# EAGLE schematic EasyBMS (EAGLE 9.6.2)
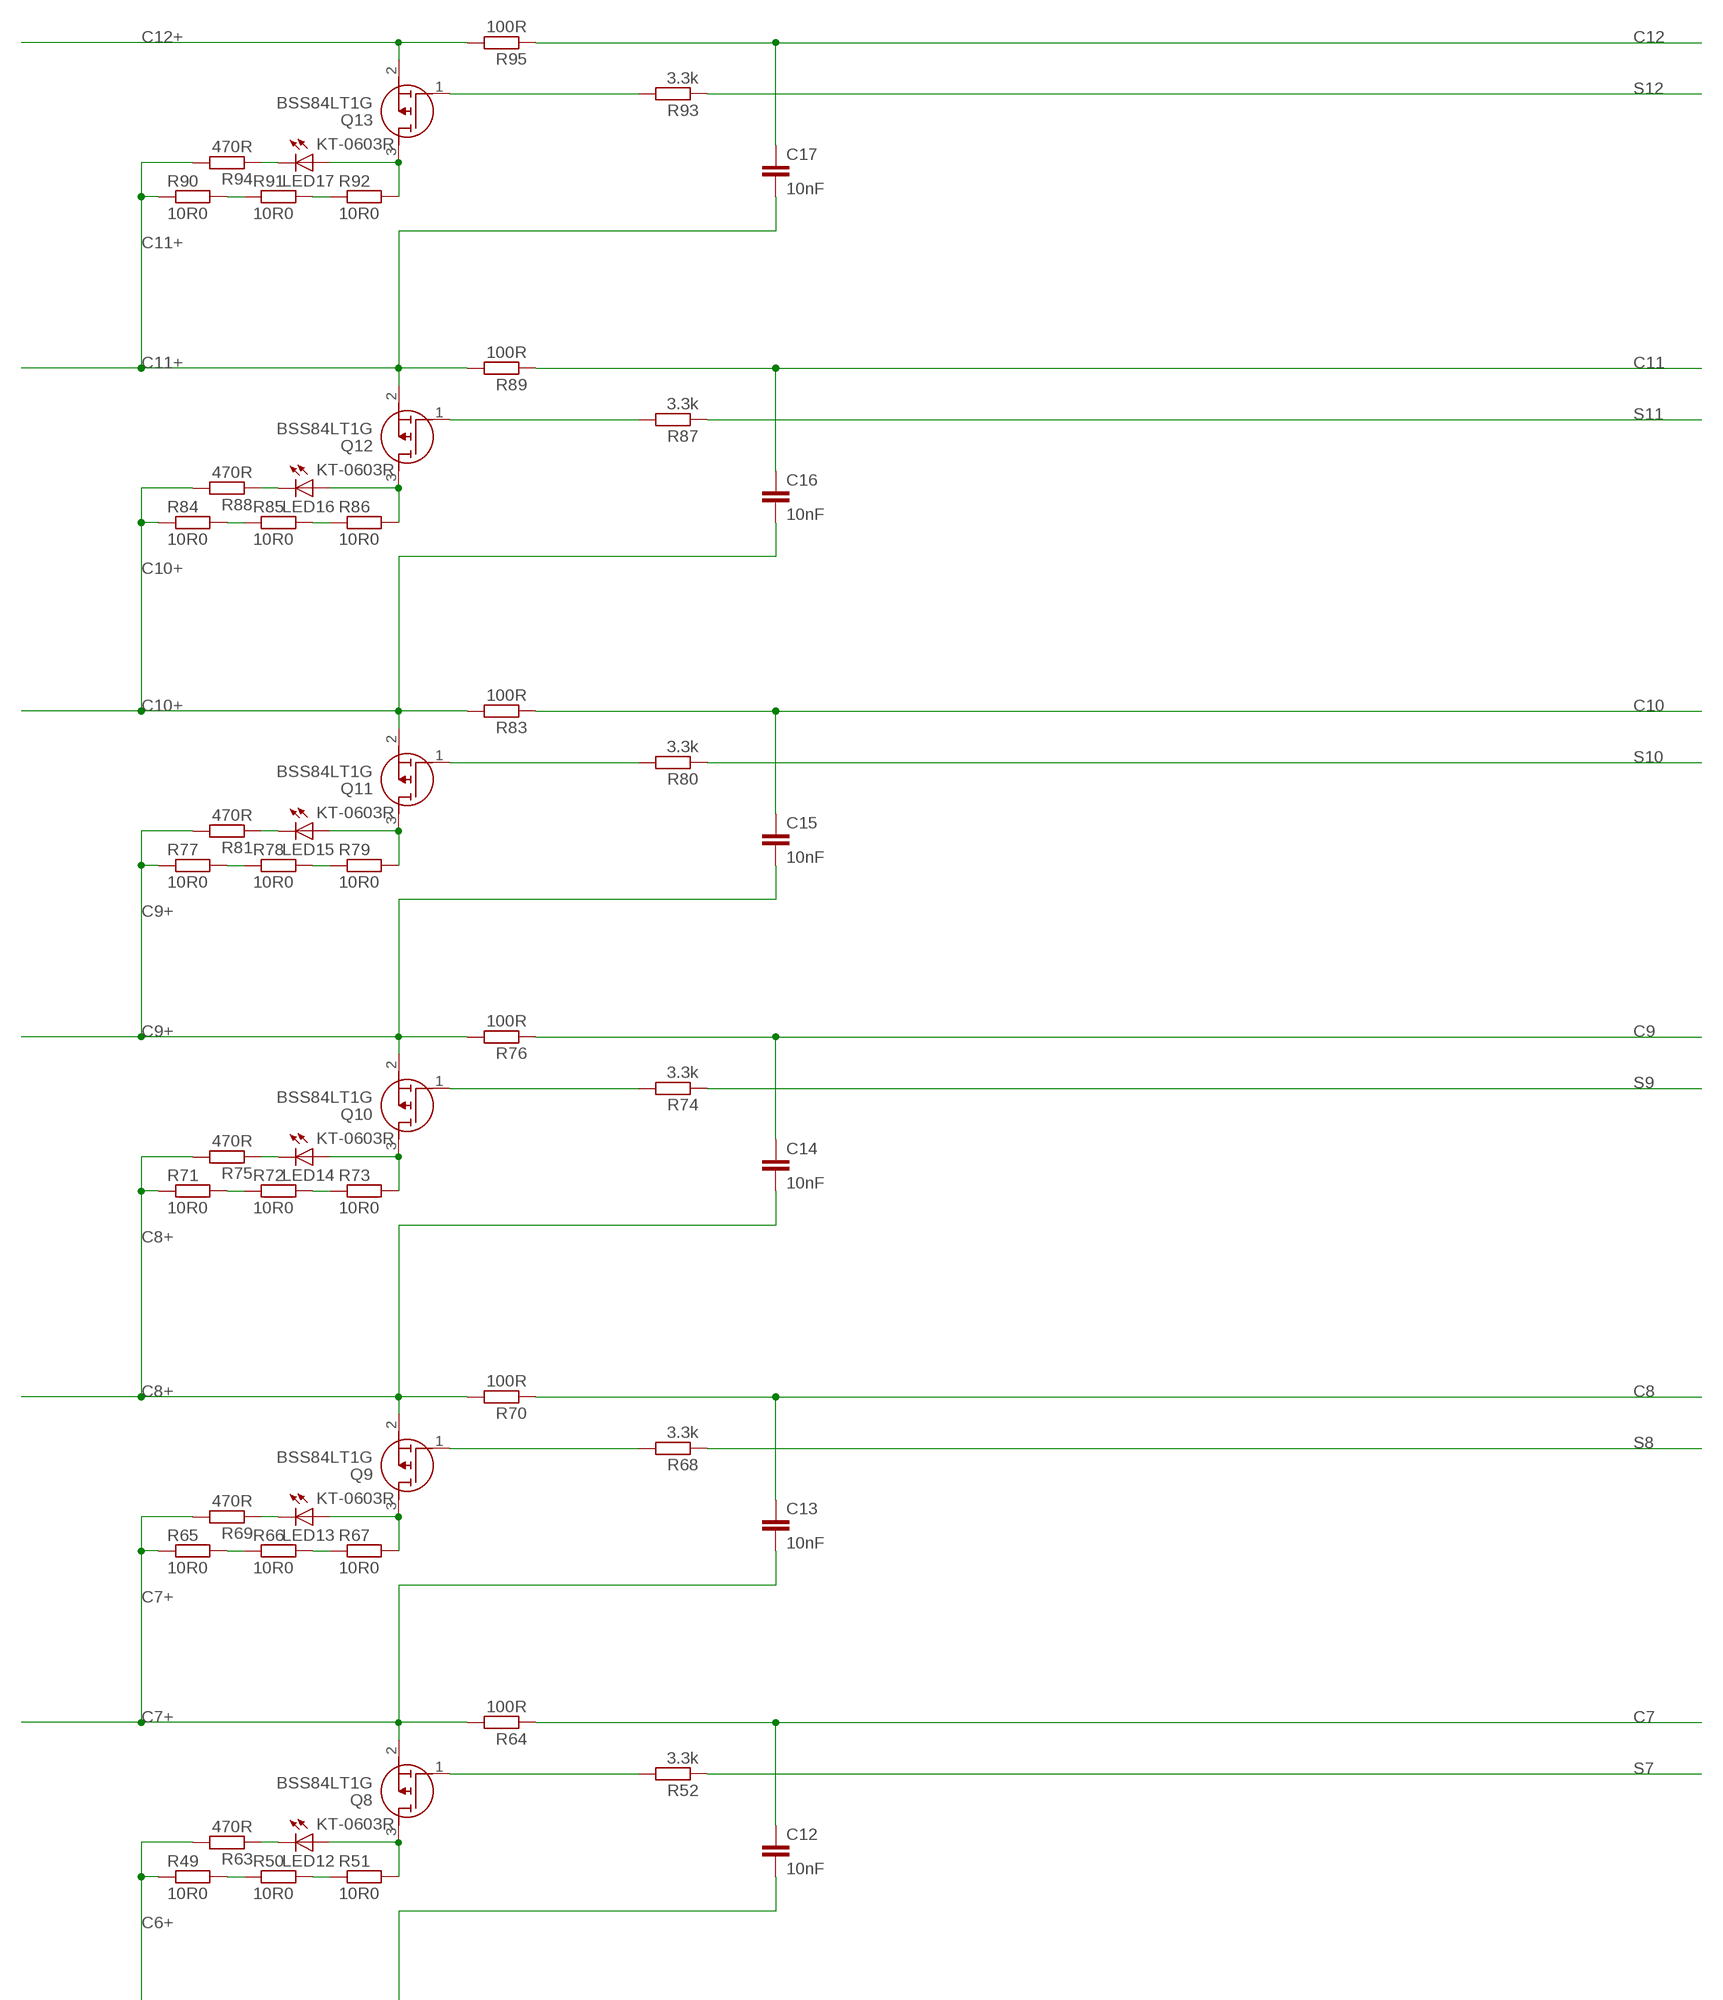
[diagram p0: schematic, sheet 1, part 1 of 3]
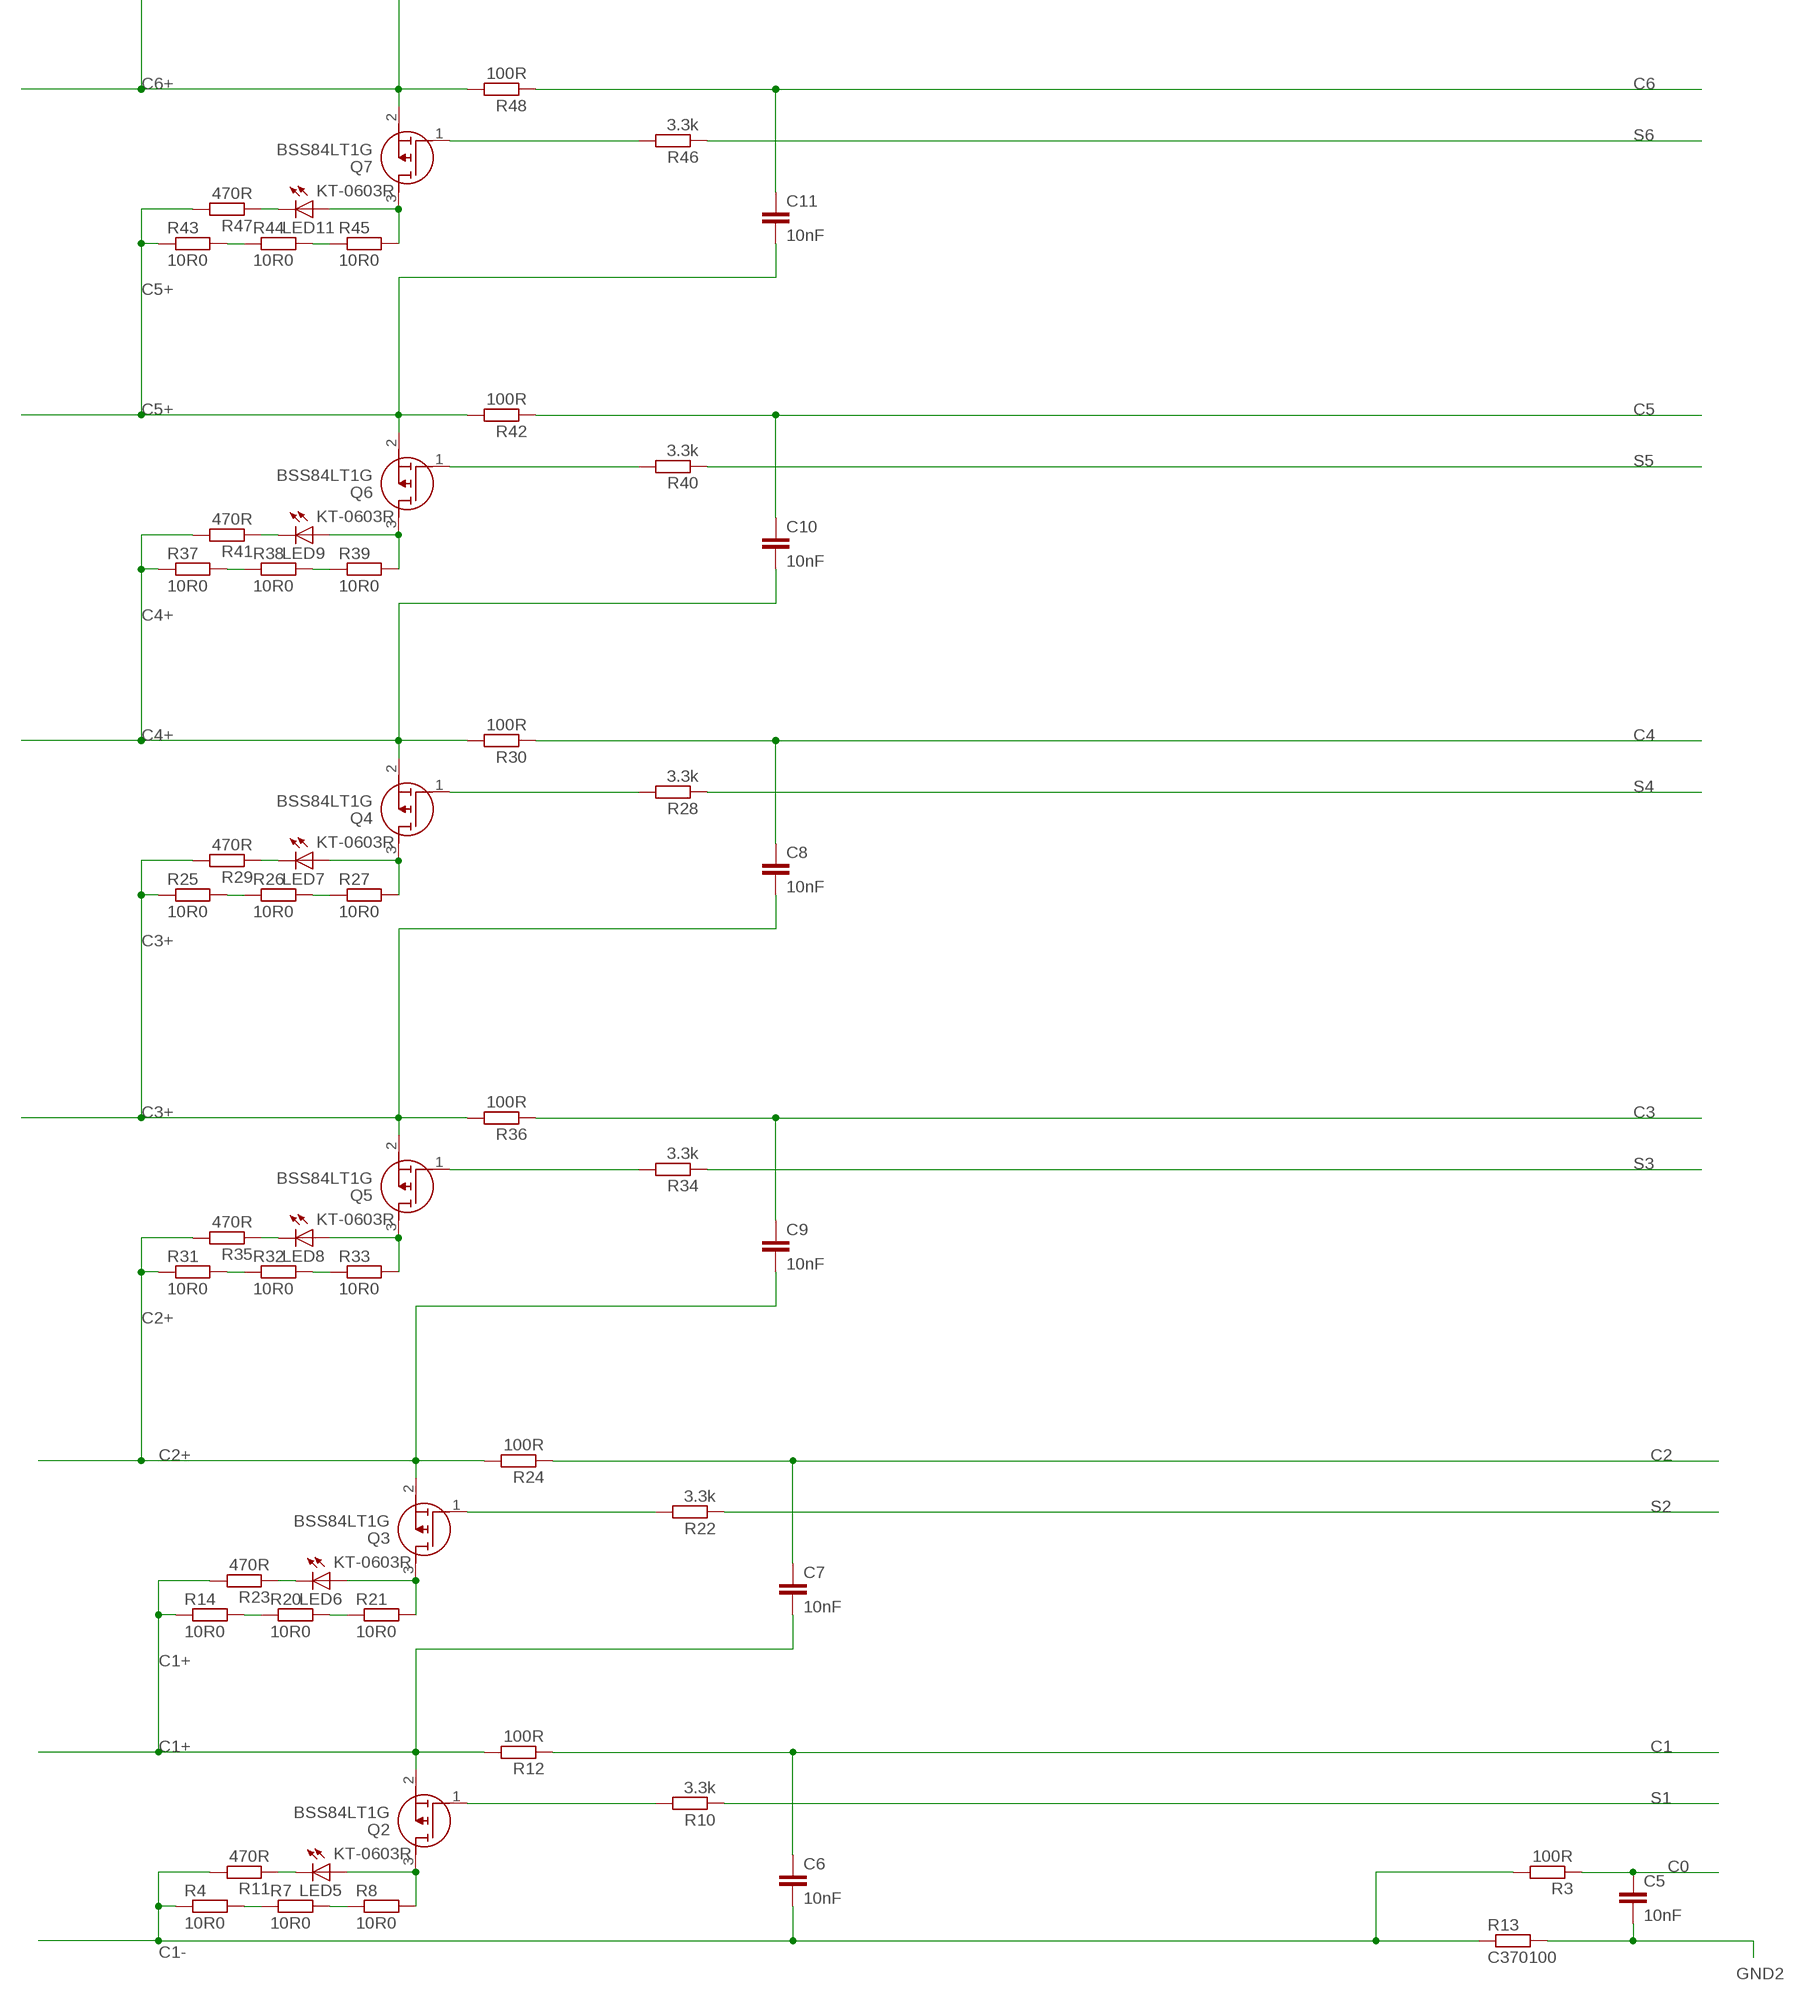
[diagram p1: schematic, sheet 1, part 2 of 3]
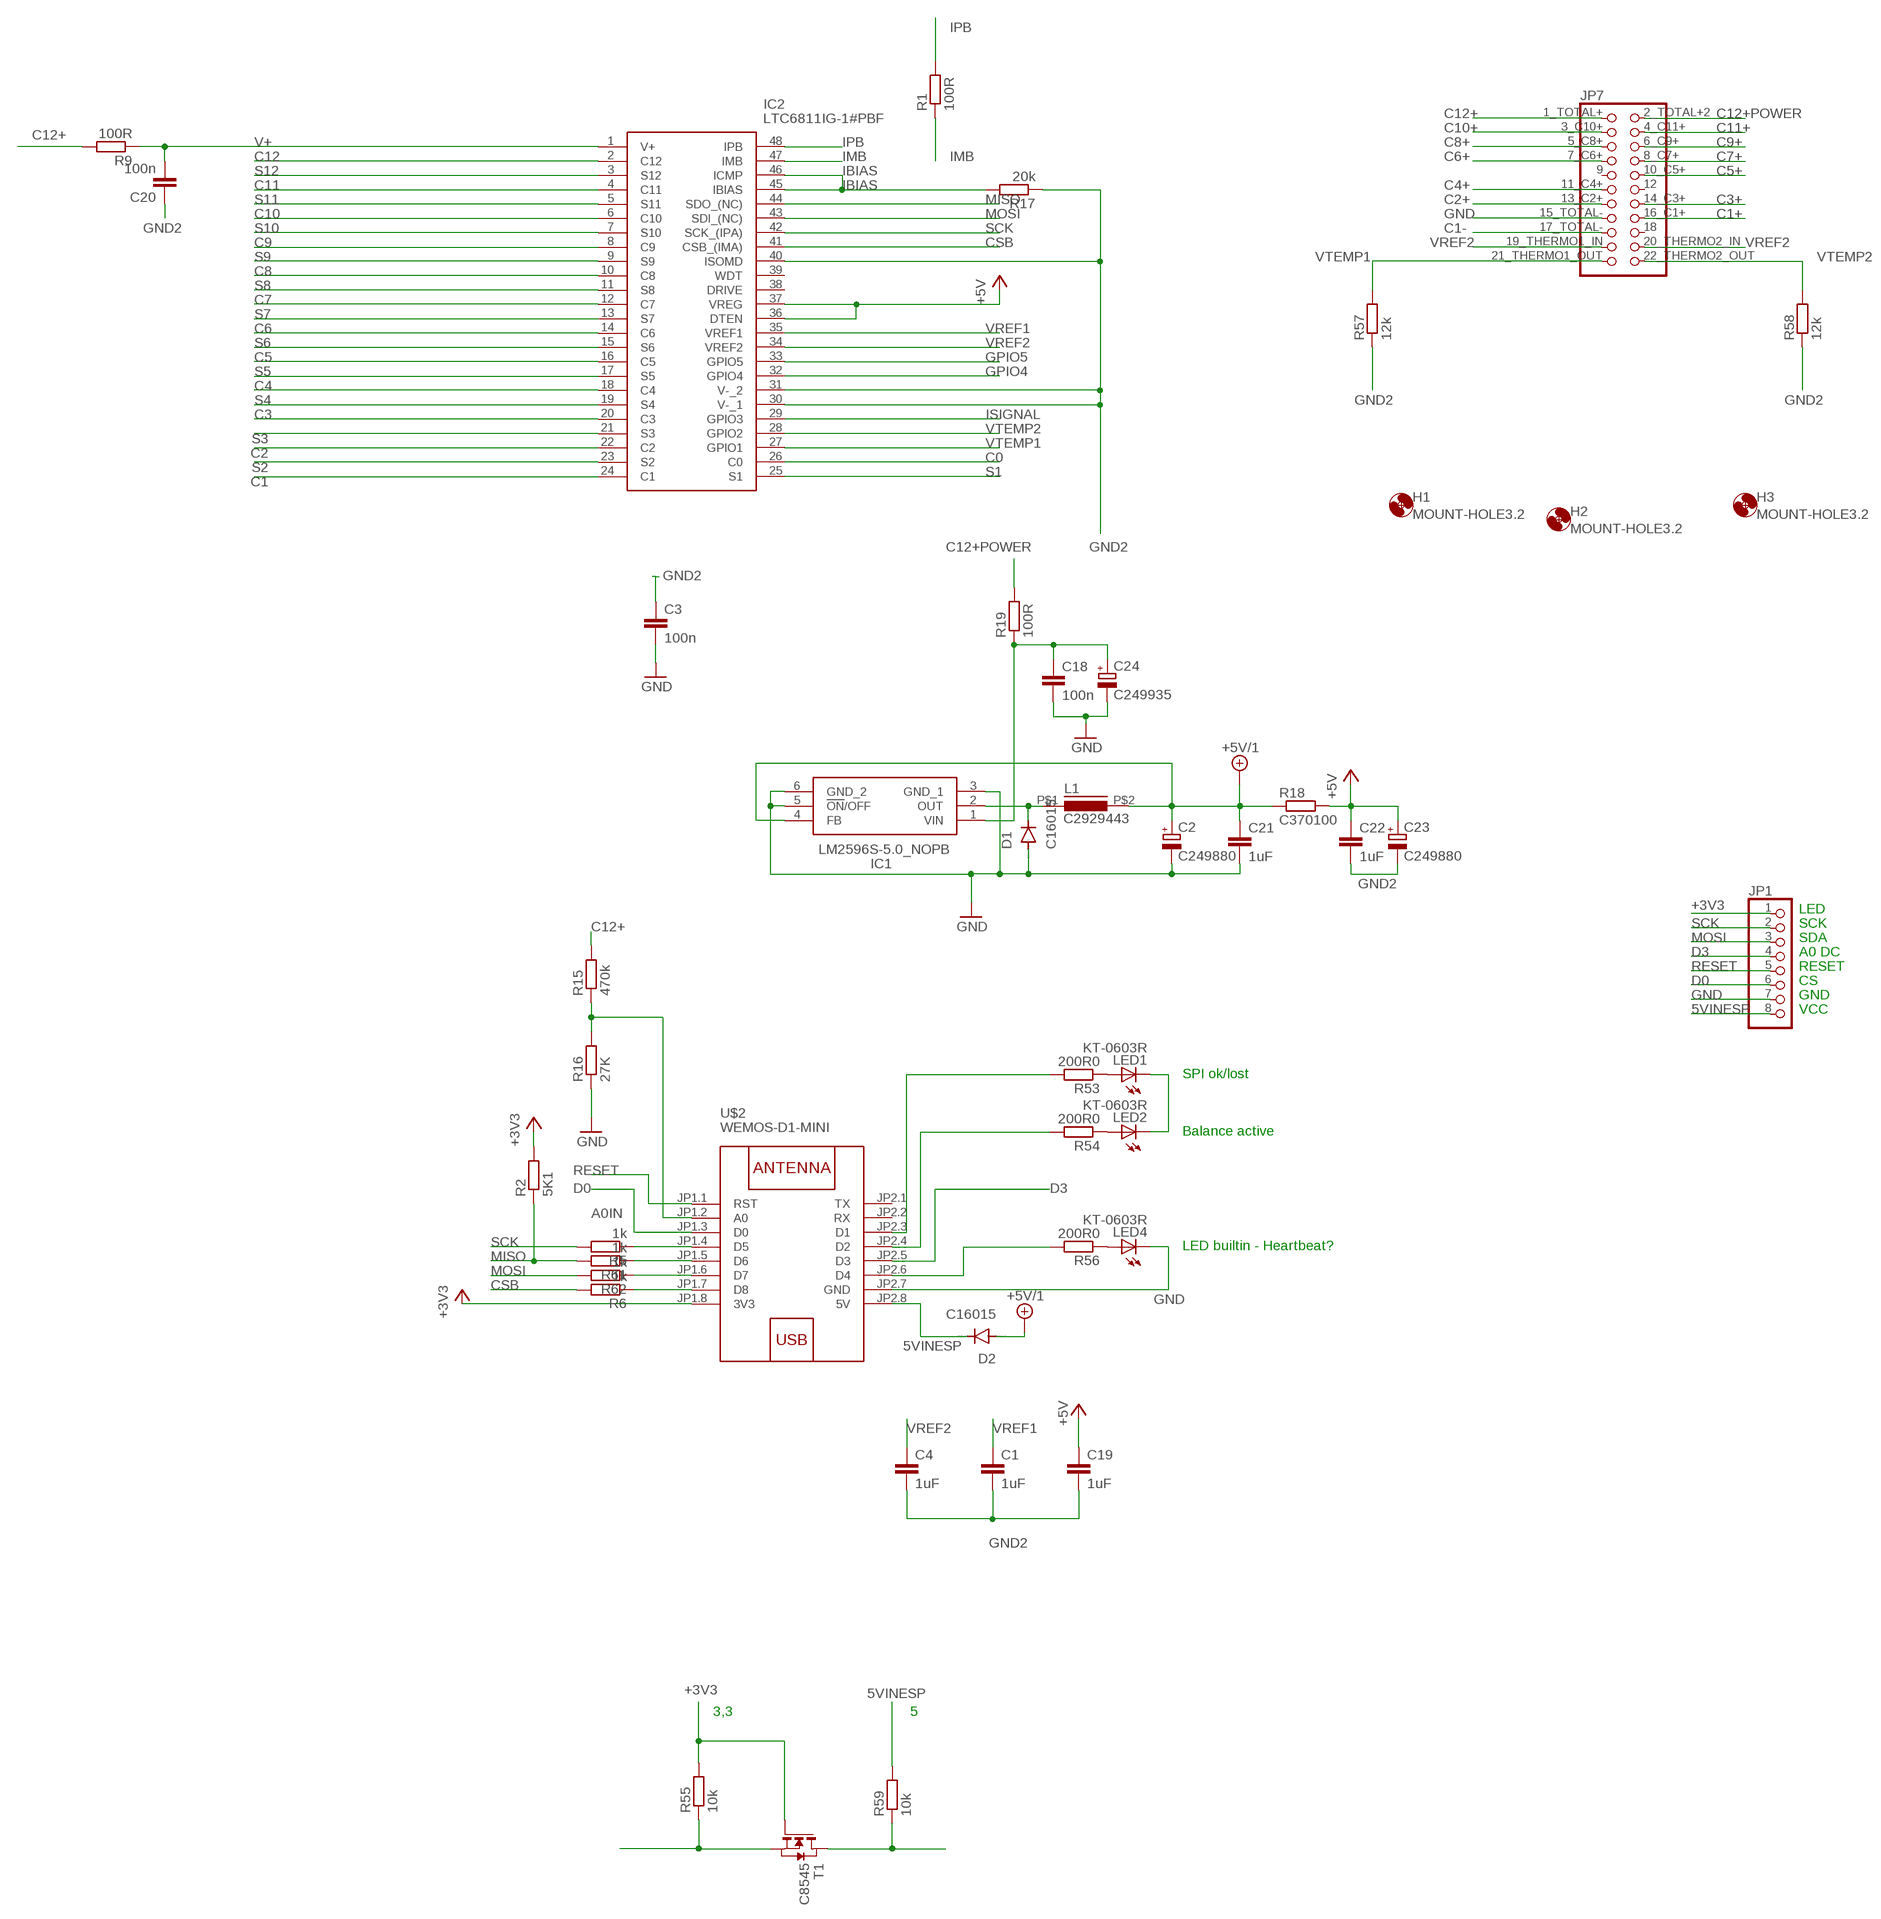
[diagram p2: schematic, sheet 1, part 3 of 3]

## Parts
C1  1uF  C-EUC1206  [C1206]
C2  C249880  CPOL-EUUD-8X10  [UD-8X10_NICHICON]
C3  100n  C-EUC0402  [C0402]
C4  1uF  C-EUC1206  [C1206]
C5  10nF  C-EUC0402  [C0402]
C6  10nF  C-EUC0402  [C0402]
C7  10nF  C-EUC0402  [C0402]
C8  10nF  C-EUC0402  [C0402]
C9  10nF  C-EUC0402  [C0402]
C10  10nF  C-EUC0402  [C0402]
C11  10nF  C-EUC0402  [C0402]
C12  10nF  C-EUC0402  [C0402]
C13  10nF  C-EUC0402  [C0402]
C14  10nF  C-EUC0402  [C0402]
C15  10nF  C-EUC0402  [C0402]
C16  10nF  C-EUC0402  [C0402]
C17  10nF  C-EUC0402  [C0402]
C18  100n  C-EUC0402  [C0402]
C19  1uF  C-EUC1206  [C1206]
C20  100n  C-EUC0402  [C0402]
C21  1uF  C-EUC1206  [C1206]
C22  1uF  C-EUC1206  [C1206]
C23  C249880  CPOL-EUUD-8X10  [UD-8X10_NICHICON]
C24  C249935  VZH471M1JTR-1616  [WCAP-ASLI_16X17(DXL)]
D1  C16015  DIODE-DO214AC  [DO214AC]
D2  C16015  DIODE-DO214AC  [DO214AC]
H1  MOUNT-HOLE3.2  [3,2]
H2  MOUNT-HOLE3.2  [3,2]
H3  MOUNT-HOLE3.2  [3,2]
IC1  LM2596S-5.0_NOPB  [KTT0005B]
IC2  LTC6811IG-1#PBF  [SOP50P780X200-48N]
JP1  PINHD-1X8  [1X08]
JP7  PINHD-2X11_MEB12S  [2X11_MEB12S]
L1  C2929443  CY75-100UH  [CY75-100UH]
LED1  KT-0603R  LEDCHIPLED_0603  [CHIPLED_0603]
LED2  KT-0603R  LEDCHIPLED_0603  [CHIPLED_0603]
LED4  KT-0603R  LEDCHIPLED_0603  [CHIPLED_0603]
LED5  KT-0603R  LEDCHIPLED_0603  [CHIPLED_0603]
LED6  KT-0603R  LEDCHIPLED_0603  [CHIPLED_0603]
LED7  KT-0603R  LEDCHIPLED_0603  [CHIPLED_0603]
LED8  KT-0603R  LEDCHIPLED_0603  [CHIPLED_0603]
LED9  KT-0603R  LEDCHIPLED_0603  [CHIPLED_0603]
LED11  KT-0603R  LEDCHIPLED_0603  [CHIPLED_0603]
LED12  KT-0603R  LEDCHIPLED_0603  [CHIPLED_0603]
LED13  KT-0603R  LEDCHIPLED_0603  [CHIPLED_0603]
LED14  KT-0603R  LEDCHIPLED_0603  [CHIPLED_0603]
LED15  KT-0603R  LEDCHIPLED_0603  [CHIPLED_0603]
LED16  KT-0603R  LEDCHIPLED_0603  [CHIPLED_0603]
LED17  KT-0603R  LEDCHIPLED_0603  [CHIPLED_0603]
Q2  BSS84LT1G  [SOT96P237X111-3N]
Q3  BSS84LT1G  [SOT96P237X111-3N]
Q4  BSS84LT1G  [SOT96P237X111-3N]
Q5  BSS84LT1G  [SOT96P237X111-3N]
Q6  BSS84LT1G  [SOT96P237X111-3N]
Q7  BSS84LT1G  [SOT96P237X111-3N]
Q8  BSS84LT1G  [SOT96P237X111-3N]
Q9  BSS84LT1G  [SOT96P237X111-3N]
Q10  BSS84LT1G  [SOT96P237X111-3N]
Q11  BSS84LT1G  [SOT96P237X111-3N]
Q12  BSS84LT1G  [SOT96P237X111-3N]
Q13  BSS84LT1G  [SOT96P237X111-3N]
R1  100R  R-EU_R0603  [R0603]
R2  5K1  R-EU_R0603  [R0603]
R3  100R  R-EU_R0402  [R0402]
R4  10R0  R-EU_R1206  [R1206]
R5  1k  R-EU_R0603  [R0603]
R6  1k  R-EU_R0603  [R0603]
R7  10R0  R-EU_R1206  [R1206]
R8  10R0  R-EU_R1206  [R1206]
R9  100R  R-EU_R0402  [R0402]
R10  3.3k  R-EU_R0402  [R0402]
R11  470R  R-EU_R0402  [R0402]
R12  100R  R-EU_R0402  [R0402]
R13  C370100  R-EU_R1206  [R1206]
R14  10R0  R-EU_R1206  [R1206]
R15  470k  R-EU_R0603  [R0603]
R16  27K  R-EU_R0603  [R0603]
R17  20k  R-EU_R0603  [R0603]
R18  C370100  R-EU_R1206  [R1206]
R19  100R  R-EU_R1206  [R1206]
R20  10R0  R-EU_R1206  [R1206]
R21  10R0  R-EU_R1206  [R1206]
R22  3.3k  R-EU_R0402  [R0402]
R23  470R  R-EU_R0402  [R0402]
R24  100R  R-EU_R0402  [R0402]
R25  10R0  R-EU_R1206  [R1206]
R26  10R0  R-EU_R1206  [R1206]
R27  10R0  R-EU_R1206  [R1206]
R28  3.3k  R-EU_R0402  [R0402]
R29  470R  R-EU_R0402  [R0402]
R30  100R  R-EU_R0402  [R0402]
R31  10R0  R-EU_R1206  [R1206]
R32  10R0  R-EU_R1206  [R1206]
R33  10R0  R-EU_R1206  [R1206]
R34  3.3k  R-EU_R0402  [R0402]
R35  470R  R-EU_R0402  [R0402]
R36  100R  R-EU_R0402  [R0402]
R37  10R0  R-EU_R1206  [R1206]
R38  10R0  R-EU_R1206  [R1206]
R39  10R0  R-EU_R1206  [R1206]
R40  3.3k  R-EU_R0402  [R0402]
R41  470R  R-EU_R0402  [R0402]
R42  100R  R-EU_R0402  [R0402]
R43  10R0  R-EU_R1206  [R1206]
R44  10R0  R-EU_R1206  [R1206]
R45  10R0  R-EU_R1206  [R1206]
R46  3.3k  R-EU_R0402  [R0402]
R47  470R  R-EU_R0402  [R0402]
R48  100R  R-EU_R0402  [R0402]
R49  10R0  R-EU_R1206  [R1206]
R50  10R0  R-EU_R1206  [R1206]
R51  10R0  R-EU_R1206  [R1206]
R52  3.3k  R-EU_R0402  [R0402]
R53  200R0  R-EU_R0603  [R0603]
R54  200R0  R-EU_R0603  [R0603]
R55  10k  R-EU_R0603  [R0603]
R56  200R0  R-EU_R0603  [R0603]
R57  12k  R-EU_R0603  [R0603]
R58  12k  R-EU_R0603  [R0603]
R59  10k  R-EU_R0603  [R0603]
R61  1k  R-EU_R0603  [R0603]
R62  1k  R-EU_R0603  [R0603]
R63  470R  R-EU_R0402  [R0402]
R64  100R  R-EU_R0402  [R0402]
R65  10R0  R-EU_R1206  [R1206]
R66  10R0  R-EU_R1206  [R1206]
R67  10R0  R-EU_R1206  [R1206]
R68  3.3k  R-EU_R0402  [R0402]
R69  470R  R-EU_R0402  [R0402]
R70  100R  R-EU_R0402  [R0402]
R71  10R0  R-EU_R1206  [R1206]
R72  10R0  R-EU_R1206  [R1206]
R73  10R0  R-EU_R1206  [R1206]
R74  3.3k  R-EU_R0402  [R0402]
R75  470R  R-EU_R0402  [R0402]
R76  100R  R-EU_R0402  [R0402]
R77  10R0  R-EU_R1206  [R1206]
R78  10R0  R-EU_R1206  [R1206]
R79  10R0  R-EU_R1206  [R1206]
R80  3.3k  R-EU_R0402  [R0402]
R81  470R  R-EU_R0402  [R0402]
R83  100R  R-EU_R0402  [R0402]
R84  10R0  R-EU_R1206  [R1206]
R85  10R0  R-EU_R1206  [R1206]
R86  10R0  R-EU_R1206  [R1206]
R87  3.3k  R-EU_R0402  [R0402]
R88  470R  R-EU_R0402  [R0402]
R89  100R  R-EU_R0402  [R0402]
R90  10R0  R-EU_R1206  [R1206]
R91  10R0  R-EU_R1206  [R1206]
R92  10R0  R-EU_R1206  [R1206]
R93  3.3k  R-EU_R0402  [R0402]
R94  470R  R-EU_R0402  [R0402]
R95  100R  R-EU_R0402  [R0402]
T1  C8545  NMOSSOT23  [SOT-23]
U$2  WEMOS-D1-MINI  [WEMOS-D1-MINI]

## Nets
5VINESP: D2.C JP1.8 R59.2 U$2.JP2.8(5V)
+3V3: JP1.1 R2.2 R55.2 T1.3(G) U$2.JP1.8(3V3)
+5V: C19.1 C22.1 C23.+ IC2.36(DTEN) IC2.37(VREG) R18.2
+5V/1: C2.+ C21.1 D2.A IC1.4(FB) L1.P$2 R18.1
A0IN: R15.1 R16.2 U$2.JP1.2(A0)
C0: C5.1 IC2.26(C0) R3.1
C1: C6.1 IC2.24(C1) R12.1
C1+: C7.2 JP7.16_C1+ Q2.2(S) R12.2 R14.1 R23.2
C1-: C6.2 JP7.17_TOTAL-(TOTAL-) R3.2 R4.1 R11.2 R13.1
C2: C7.1 IC2.22(C2) R24.1
C2+: C9.2 JP7.13_C2+ Q3.2(S) R24.2 R31.1 R35.2
C3: C9.1 IC2.20(C3) R36.1
C3+: C8.2 JP7.14_C3+ Q5.2(S) R25.1 R29.2 R36.2
C4: C8.1 IC2.18(C4) R30.1
C4+: C10.2 JP7.11_C4+ Q4.2(S) R30.2 R37.1 R41.2
C5: C10.1 IC2.16(C5) R42.1
C5+: C11.2 JP7.10_C5+ Q6.2(S) R42.2 R43.1 R47.2
C6: C11.1 IC2.14(C6) R48.1
C6+: C12.2 JP7.7_C6+ Q7.2(S) R48.2 R49.1 R63.2
C7: C12.1 IC2.12(C7) R64.1
C7+: C13.2 JP7.8_C7+ Q8.2(S) R64.2 R65.1 R69.2
C8: C13.1 IC2.10(C8) R70.1
C8+: C14.2 JP7.5_C8+ Q9.2(S) R70.2 R71.1 R75.2
C9: C14.1 IC2.8(C9) R76.1
C9+: C15.2 JP7.6_C9+ Q10.2(S) R76.2 R77.1 R81.2
C10: C15.1 IC2.6(C10) R83.1
C10+: C16.2 JP7.3_C10+ Q11.2(S) R83.2 R84.1 R88.2
C11: C16.1 IC2.4(C11) R89.1
C11+: C17.2 JP7.4_C11+ Q12.2(S) R89.2 R90.1 R94.2
C12: C17.1 IC2.2(C12) R95.1
C12+: JP7.1_TOTAL+ Q13.2(S) R9.2 R15.2 R95.2
C12+POWER: JP7.2_TOTAL+2(2_CTOTAL+) R19.2
CSB: IC2.41(CSB_(IMA)) R6.2
D0: JP1.6 U$2.JP1.3(D0)
D3: JP1.4 U$2.JP2.5(D3)
GND: C2.- C3.2 C18.2 C21.2 C24.2(-) D1.A IC1.3(GND_1) IC1.5(!ON!/OFF) IC1.6(GND_2) JP1.7 JP7.15_TOTAL- LED4.C R16.1 U$2.JP2.7(GND)
GND2: C1.2 C3.1 C4.2 C5.2 C19.2 C20.1 C22.2 C23.- IC2.30(V-_1) IC2.31(V-_2) IC2.40(ISOMD) R13.2 R17.1 R57.1 R58.1
GPIO4: IC2.32(GPIO4)
GPIO5: IC2.33(GPIO5)
IBIAS: IC2.45(IBIAS) IC2.46(ICMP) R17.2
IMB: IC2.47(IMB) R1.1
IPB: IC2.48(IPB) R1.2
ISIGNAL: IC2.29(GPIO3)
MISO: IC2.44(SDO_(NC)) R2.1 R61.2
MOSI: IC2.43(SDI_(NC)) JP1.3 R62.2
MOSIESP: R62.1 U$2.JP1.6(D7)
N$1: LED1.A R53.1
N$2: LED2.A R54.1
N$3: LED1.C LED2.C
N$4: LED4.A R56.1
N$6: R55.1 T1.2(S)
N$7: R59.1 T1.1(D)
N$8: R4.2 R7.1
N$9: R7.2 R8.1
N$10: LED5.A Q2.3(D) R8.2
N$11: Q2.1(G) R10.2
N$12: LED5.C R11.1
N$13: R14.2 R20.1
N$14: R20.2 R21.1
N$15: R6.1 U$2.JP1.7(D8)
N$16: LED6.A Q3.3(D) R21.2
N$17: D1.C IC1.2(OUT) L1.P$1
N$19: Q3.1(G) R22.2
N$20: LED6.C R23.1
N$21: R25.2 R26.1
N$22: R26.2 R27.1
N$23: LED7.A Q4.3(D) R27.2
N$24: Q4.1(G) R28.2
N$26: LED7.C R29.1
N$27: R31.2 R32.1
N$28: R32.2 R33.1
N$29: LED8.A Q5.3(D) R33.2
N$30: R56.2 U$2.JP2.6(D4)
N$31: Q5.1(G) R34.2
N$32: LED8.C R35.1
N$33: R37.2 R38.1
N$34: R38.2 R39.1
N$35: LED9.A Q6.3(D) R39.2
N$36: Q6.1(G) R40.2
N$37: LED9.C R41.1
N$38: R43.2 R44.1
N$39: R44.2 R45.1
N$40: LED11.A Q7.3(D) R45.2
N$41: Q7.1(G) R46.2
N$42: LED11.C R47.1
N$43: R49.2 R50.1
N$44: R50.2 R51.1
N$45: LED12.A Q8.3(D) R51.2
N$46: Q8.1(G) R52.2
N$47: LED12.C R63.1
N$48: R65.2 R66.1
N$49: R66.2 R67.1
N$50: LED13.A Q9.3(D) R67.2
N$51: Q9.1(G) R68.2
N$52: LED13.C R69.1
N$53: R71.2 R72.1
N$54: R72.2 R73.1
N$55: LED14.A Q10.3(D) R73.2
N$56: Q10.1(G) R74.2
N$57: LED14.C R75.1
N$58: R77.2 R78.1
N$59: R78.2 R79.1
N$60: LED15.A Q11.3(D) R79.2
N$61: Q11.1(G) R80.2
N$62: LED15.C R81.1
N$63: R84.2 R85.1
N$64: R85.2 R86.1
N$65: LED16.A Q12.3(D) R86.2
N$66: Q12.1(G) R87.2
N$67: LED16.C R88.1
N$68: R90.2 R91.1
N$69: R91.2 R92.1
N$70: R53.2 U$2.JP2.3(D1)
N$71: LED17.A Q13.3(D) R92.2
N$72: Q13.1(G) R93.2
N$73: R61.1 U$2.JP1.5(D6)
N$74: LED17.C R94.1
N$75: C18.1 C24.1(+) IC1.1(VIN) R19.1
N$124: R54.2 U$2.JP2.4(D2)
RESET: JP1.5 U$2.JP1.1(RST)
S1: IC2.25(S1) R10.1
S2: IC2.23(S2) R22.1
S3: IC2.21(S3) R34.1
S4: IC2.19(S4) R28.1
S5: IC2.17(S5) R40.1
S6: IC2.15(S6) R46.1
S7: IC2.13(S7) R52.1
S8: IC2.11(S8) R68.1
S9: IC2.9(S9) R74.1
S10: IC2.7(S10) R80.1
S11: IC2.5(S11) R87.1
S12: IC2.3(S12) R93.1
SCK: IC2.42(SCK_(IPA)) JP1.2 R5.2
SCKESP: R5.1 U$2.JP1.4(D5)
V+: C20.2 IC2.1(V+) R9.1
VREF1: C1.1 IC2.35(VREF1)
VREF2: C4.1 IC2.34(VREF2) JP7.19_THERMO1_IN JP7.20_THERMO2_IN
VTEMP1: IC2.27(GPIO1) JP7.21_THERMO1_OUT R57.2
VTEMP2: IC2.28(GPIO2) JP7.22_THERMO2_OUT R58.2
Unconnected: IC2.38(DRIVE) IC2.39(WDT) JP7.9 JP7.12 JP7.18 U$2.JP2.1(TX) U$2.JP2.2(RX)

## Notes on the sheet
- LED
- SCK
- SDA
- A0 DC
- RESET
- CS
- GND
- VCC
- SPI ok/lost
- Balance active
- LED builtin - Heartbeat?
- 3,3 | 5

## Library data of the parts
C1 C3-C22 = rcl:C-EU: CAPACITOR, European symbol
C2 C23 = rcl:CPOL-EU: POLARIZED CAPACITOR, European symbol; SPICEPREFIX: C
C24 = SamacSys_Parts:VZH471M1JTR-1616
D1 D2 = diode:DIODE-: DIODE
H1-H3 = holes:MOUNT-HOLE: MOUNTING HOLE with drill center marker
IC1 = SamacSys_Parts:LM2596S-5.0_NOPB: Switching Voltage Regulators 150 KHZ 3A STEP-DOWN VLTG REG Source: Datasheet <https://www.ti.com/lit/gpn/LM2596>; DESCRIPTION: Switching Voltage Regulators 150 KHZ 3A STEP-DOWN VLTG REG; HEIGHT: mm; MANUFACTURER_NAME: Texas Instruments; MANUFACTURER_PART_NUMBER: LM2596S-5.0/NOPB; MOUSER_PART_NUMBER: 926-LM2596S-5.0/NOPB; MOUSER_PRICE-STOCK: https://www.mouser.co.uk/ProductDetail/Texas-Instruments/LM2596S-5.0-NOPB?qs=X1J7HmVL2ZHVjCOmW%252BYINA%3D%3D
IC2 = SamacSys_Parts:LTC6811IG-1#PBF: Battery Monitoring 5.7V Automotive 48-Pin SSOP Tube Source: Datasheet <https://www.arrow.com/en/products/ltc6811ig-1pbf/analog-devices>; DESCRIPTION: Battery Monitoring 5.7V Automotive 48-Pin SSOP Tube; HEIGHT: 2mm; MANUFACTURER_NAME: Analog Devices; MANUFACTURER_PART_NUMBER: LTC6811IG-1#PBF; MOUSER_PART_NUMBER: 584-LTC6811IG-1#PBF; MOUSER_PRICE-STOCK: https://www.mouser.co.uk/ProductDetail/Analog-Devices/LTC6811IG-1PBF?qs=oahfZPh6IAL9qJ0YPEk6qg%3D%3D
JP1 = pinhead:PINHD-1X8: PIN HEADER
JP7 = pinhead_own:PINHD-2X11_MEB12S: PIN HEADER
L1 = SamacSys_Parts:CY75-100UH
LED1 LED2 LED4-LED9 LED11-LED17 = led:LED: LED OSRAM: - CHIPLED LG R971, LG N971, LY N971, LG Q971, LY Q971, LO R971, LY R971 LH N974, LH R974 LS Q976, LO Q976, LY Q976 LO Q996 - Hyper CHIPLED LW Q18S LB Q993, LB Q99A, LB R99A - SideLED LS A670, LO A670, LY A670, LG A670, LP A670 LB A673, LV A673, LT A673, LW A673 LH A674 LY A675 LS A676, LA A676, LO A676, LY A676, LW A676 LS A679, LY A679, LG A679 - Hyper Micro SIDELED® LS Y876, LA Y876, LO Y876, LY Y876 LT Y87S - SmartLED LW L88C, LW L88S LB L89C, LB L89S, LG L890 LS L89K, LO L89K, LY L89K LS L896, LA L896, LO L896, LY L896 - TOPLED LS T670, LO T670, LY T670, LG T670, LP T670 LSG T670, LSP T670, LSY T670, LOP T670, LYG T670 LG T671, LOG T671, LSG T671 LB T673, LV T673, LT T673, LW T673 LH T674 LS T676, LA T676, LO T676, LY T676, LB T676, LH T676, LSB T676, LW T676 LB T67C, LV T67C, LT T67C, LS T67K, LO T67K, LY T67K, LW E67C LS E67B, LA E67B, LO E67B, LY E67B, LB E67C, LV E67C, LT E67C LW T67C LS T679, LY T679, LG T679 LS T770, LO T770, LY T770, LG T770, LP T770 LB T773, LV T773, LT T773, LW T773 LH T774 LS E675, LA E675, LY E675, LS T675 LS T776, LA T776, LO T776, LY T776, LB T776 LHGB T686 LT T68C, LB T68C - Hyper Mini TOPLED® LB M676 - Mini TOPLED Santana® LG M470 LS M47K, LO M47K, LY M47K Source: http://www.osram.convergy.de LUXEON: - LUMILED® LXK2-PW12-R00, LXK2-PW12-S00, LXK2-PW14-U00, LXK2-PW14-V00 LXK2-PM12-R00, LXK2-PM12-S00, LXK2-PM14-U00 LXK2-PE12-Q00, LXK2-PE12-R00, LXK2-PE12-S00, LXK2-PE14-T00, LXK2-PE14-U00 LXK2-PB12-K00, LXK2-PB12-L00, LXK2-PB12-M00, LXK2-PB14-N00, LXK2-PB14-P00, LXK2-PB14-Q00 LXK2-PR12-L00, LXK2-PR12-M00, LXK2-PR14-Q00, LXK2-PR14-R00 LXK2-PD12-Q00, LXK2-PD12-R00, LXK2-PD12-S00 LXK2-PH12-R00, LXK2-PH12-S00 LXK2-PL12-P00, LXK2-PL12-Q00, LXK2-PL12-R00 Source: www.luxeon.com KINGBRIGHT: KA-3528ASYC Source: www.kingbright.com
Q2-Q13 = SamacSys_Parts:BSS84LT1G: MOSFET 50V 130mA P-Channel Source: Datasheet <http://www.onsemi.com/pub/Collateral/BSS84LT1-D.PDF>; DESCRIPTION: MOSFET 50V 130mA P-Channel; HEIGHT: 1.11mm; MANUFACTURER_NAME: ON Semiconductor; MANUFACTURER_PART_NUMBER: BSS84LT1G; MOUSER_PART_NUMBER: 863-BSS84LT1G; MOUSER_PRICE-STOCK: https://www.mouser.co.uk/ProductDetail/ON-Semiconductor/BSS84LT1G?qs=vNc2DXHODiKIGu9QIvMAfw%3D%3D
R1-R59 R61-R81 R83-R95 = rcl:R-EU_: RESISTOR, European symbol; SPICEPREFIX: R
T1 = zetex:NMOSSOT23: MOS FET; OC_FARNELL: unknown; OC_NEWARK: unknown
U$2 = diy-modules:WEMOS-D1-MINI: WEMOS D1 mini: Mini Wi-Fi Board based on ESP-8266 device More details can be found here: https://www.wemos.cc/product/d1-mini.html Click here to find device on ebay.com <http://www.ebay.com/sch/wemos+d1+mini+nodemcu>